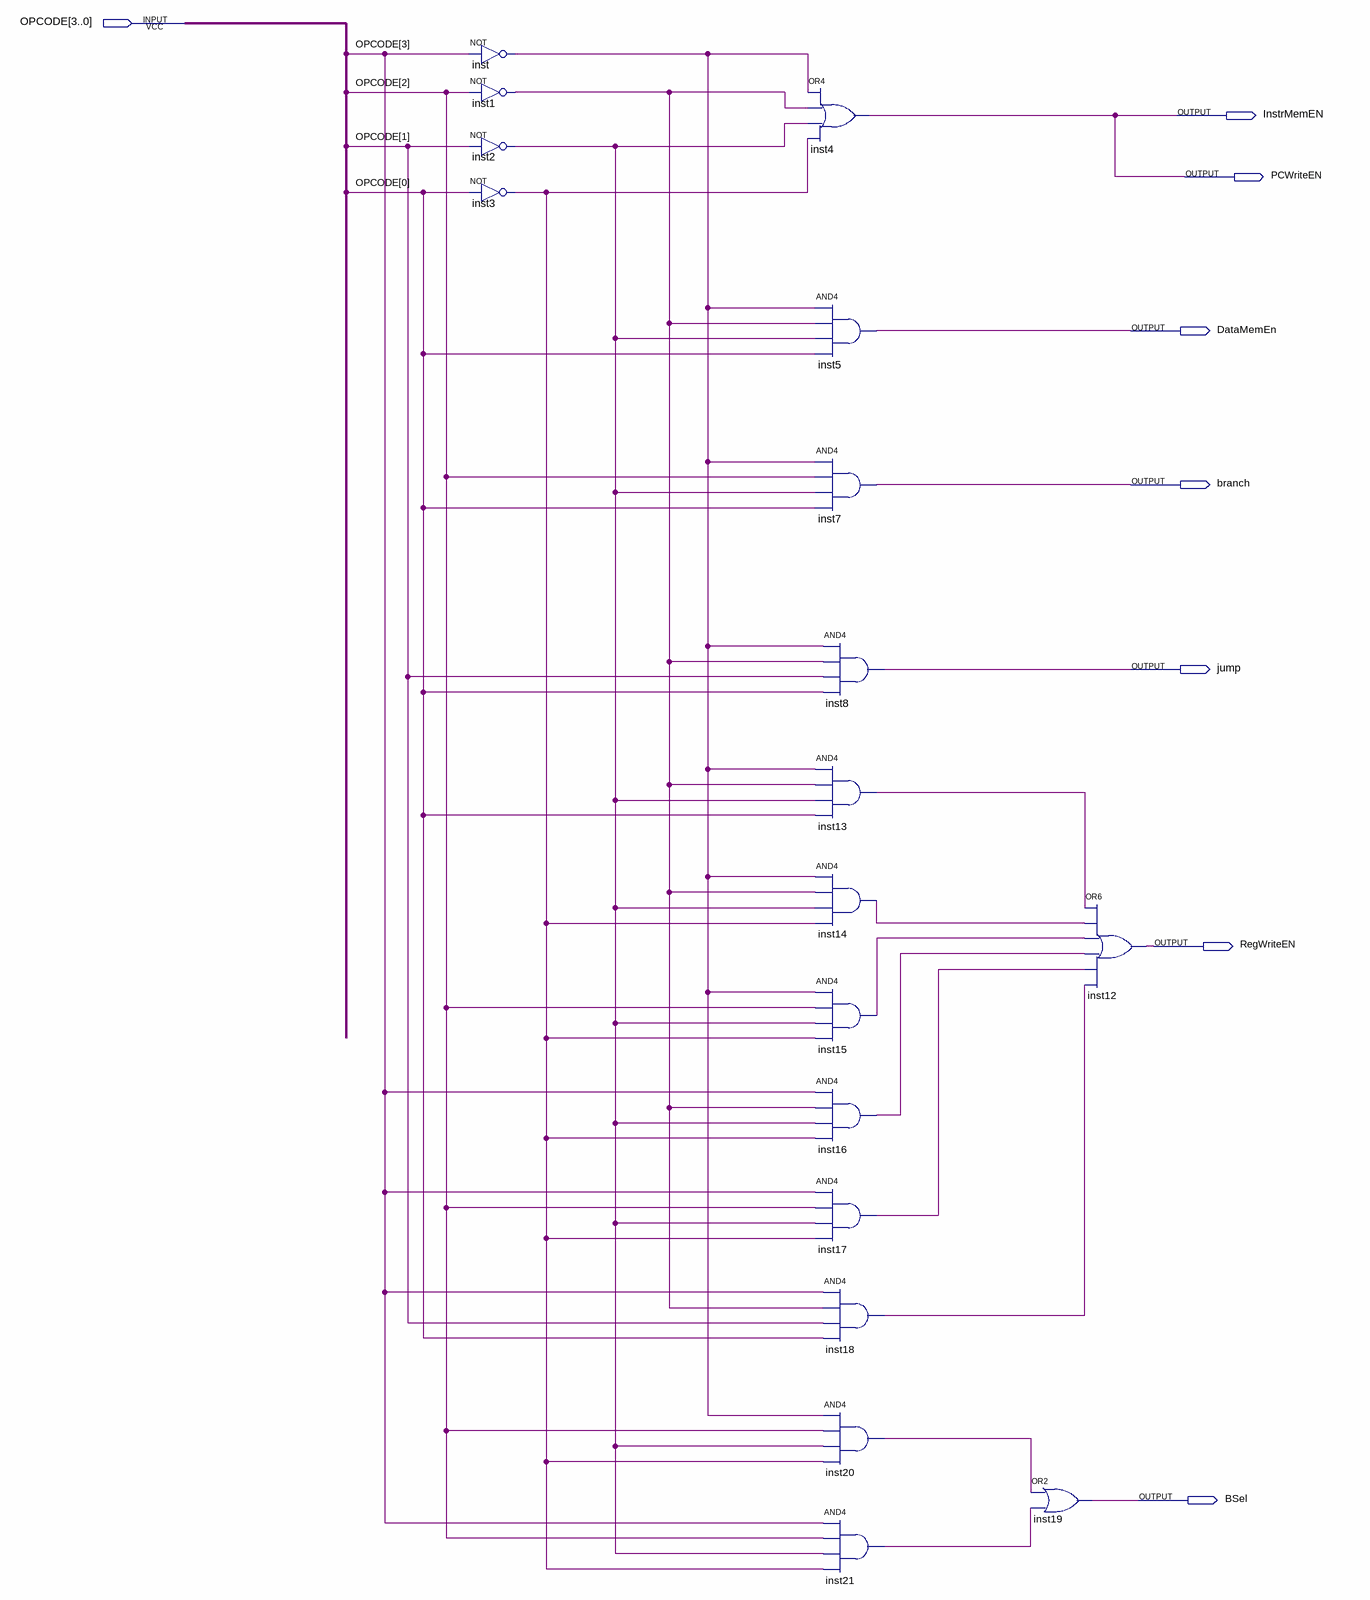
[diagram p0: schematic sheet]
// Quartus schematic controlUNIT.bdf as structural Verilog: 18 symbols, 8 pins
module controlUNIT (
  input  [3:0] OPCODE,
  output InstrMemEN,
  output PCWriteEN,
  output DataMemEn,
  output branch,
  output jump,
  output RegWriteEN,
  output BSel
);

  wire inst1_out, inst2_out, inst3_out, inst13_out, inst14_out, inst15_out, inst16_out, inst17_out,
       inst18_out, inst20_out, inst21_out, inst_out;

  not inst (inst_out, OPCODE[3]);
  not inst1 (inst1_out, OPCODE[2]);
  not inst2 (inst2_out, OPCODE[1]);
  not inst3 (inst3_out, OPCODE[0]);
  or inst4 (InstrMemEN, inst_out, inst1_out, inst2_out, inst3_out);
  and inst5 (DataMemEn, inst_out, inst1_out, inst2_out, OPCODE[0]);
  and inst7 (branch, inst_out, OPCODE[2], inst2_out, OPCODE[0]);
  and inst8 (jump, inst_out, inst1_out, OPCODE[1], OPCODE[0]);
  and inst13 (inst13_out, inst_out, inst1_out, inst2_out, OPCODE[0]);
  and inst14 (inst14_out, inst_out, inst1_out, inst2_out, inst3_out);
  and inst15 (inst15_out, inst_out, OPCODE[2], inst2_out, inst3_out);
  and inst16 (inst16_out, OPCODE[3], inst1_out, inst2_out, inst3_out);
  and inst17 (inst17_out, OPCODE[3], OPCODE[2], inst2_out, inst3_out);
  and inst18 (inst18_out, OPCODE[3], inst1_out, OPCODE[1], OPCODE[0]);
  and inst20 (inst20_out, inst_out, OPCODE[2], inst2_out, inst3_out);
  and inst21 (inst21_out, OPCODE[3], OPCODE[2], inst2_out, inst3_out);
  or inst19 (BSel, inst20_out, inst21_out);
  or inst12 (RegWriteEN, inst13_out, inst14_out, inst15_out, inst16_out, inst17_out, inst18_out);

  assign PCWriteEN = InstrMemEN;
endmodule
